# EAGLE design Esp8266-01_PACSSol (EAGLE 9.6.2)
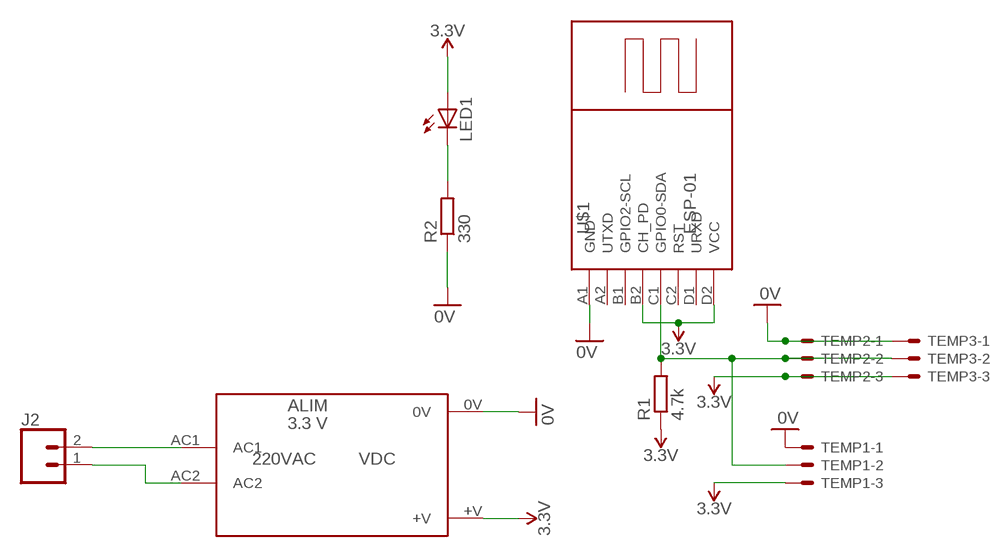
[diagram p0: schematic, sheet 1]

## Parts
ALIM  3.3 V  TSP05-5V-3W  [TSP05-VDC-3W]
J2  CONN_025MM  [BORNIER_A_VIS_2_5.12MM]
LED1  LED5MM_F  [LED5MM]
R1  4.7k  R-EU_0207/10  [0207/10]
R2  330  R-EU_0207/10  [0207/10]
TEMP1  JST-XH-03-PIN-LONG-PAD  [JST-XH-03-PACKAGE-LONG-PAD]
TEMP2  JST-XH-03-PIN-LONG-PAD  [JST-XH-03-PACKAGE-LONG-PAD]
TEMP3  JST-XH-03-PIN-LONG-PAD  [JST-XH-03-PACKAGE-LONG-PAD]
U$1  ESP-01  [ESP-01]

## Nets
0V: ALIM.0V R2.1 TEMP1.1 TEMP2.1 TEMP3.1 U$1.A1(GND)
3.3V: ALIM.+V LED1.A R1.1 TEMP1.3 TEMP2.3 TEMP3.3 U$1.B2(CH_PD) U$1.D2(VCC)
N$1: ALIM.AC1 J2.2
N$2: ALIM.AC2 J2.1
N$3: LED1.K(C) R2.2
N$4: R1.2 TEMP1.2 TEMP2.2 TEMP3.2 U$1.C1(GPIO0-SDA)
Unconnected: U$1.A2(UTXD) U$1.B1(GPIO2-SCL) U$1.C2(RST) U$1.D1(URXD)

## Library data of the parts
ALIM = _Remy:TSP05-5V-3W
J2 = _Remy:CONN_02: Multi connection point. Often used as Generic Header-pin footprint for 0.1 inch spaced/style header connections On any of the 0.1 inch spaced packages, you can populate with these: Break Away Headers - Straight <https://www.sparkfun.com/products/116> (PRT-00116) Break Away Male Headers - Right Angle <https://www.sparkfun.com/products/553> (PRT-00553) Female Headers <https://www.sparkfun.com/products/115> (PRT-00115) Break Away Headers - Machine Pin <https://www.sparkfun.com/products/117> (PRT-00117) Break Away Female Headers - Swiss Machine Pin <https://www.sparkfun.com/products/743> (PRT-00743) For SCREWTERMINALS and SPRING TERMINALS visit here: Screw Terimnals on SparkFun.com <https://www.sparkfun.com/search/results?term=Screw+Terminals> (5mm/3.5mm/2.54mm spacing) This device is also useful as a general connection point to wire up your design to another part of your project. Our various solder wires solder well into these plated through hole pads. Hook-Up Wire - Assortment (Stranded, 22 AWG) <https://www.sparkfun.com/products/11375> (PRT-11375) Hook-Up Wire - Assortment (Solid Core, 22 AWG) <https://www.sparkfun.com/products/11367> (PRT-11367) View the entire wire category on our website here <https://www.sparkfun.com/categories/141> Special notes: Molex polarized connector foot print use with: PRT-08233 with associated crimp pins and housings. 2.54_SCREWTERM for use with PRT-10571. 3.5mm Screw Terminal footprints for PRT-08084 5mm Screw Terminal footprints for use with PRT-08432; SF_SKU: PRT-08432
LED1 = 04_Remy:LED: LEDS
R1 R2 = 04_Remy:R-EU_: RESISTOR, European symbol
TEMP1-TEMP3 = con-JST XH Connectors v1-0:JST-XH-03-PIN: JST XH Connector 2 Pin Wire to board connector. Pitch: 2,54 mm, (0.100") Number of pins: 3 Created by Rembrandt Electronics www.rembrandtelectronics.com
U$1 = _Remy:ESP-01: Wireless Wi-Fi ESP-01 Module based on ESP8266 chip Click here to find device on ebay.com <http://www.ebay.com/sch/esp8266+esp+01+transceiver>

## Board
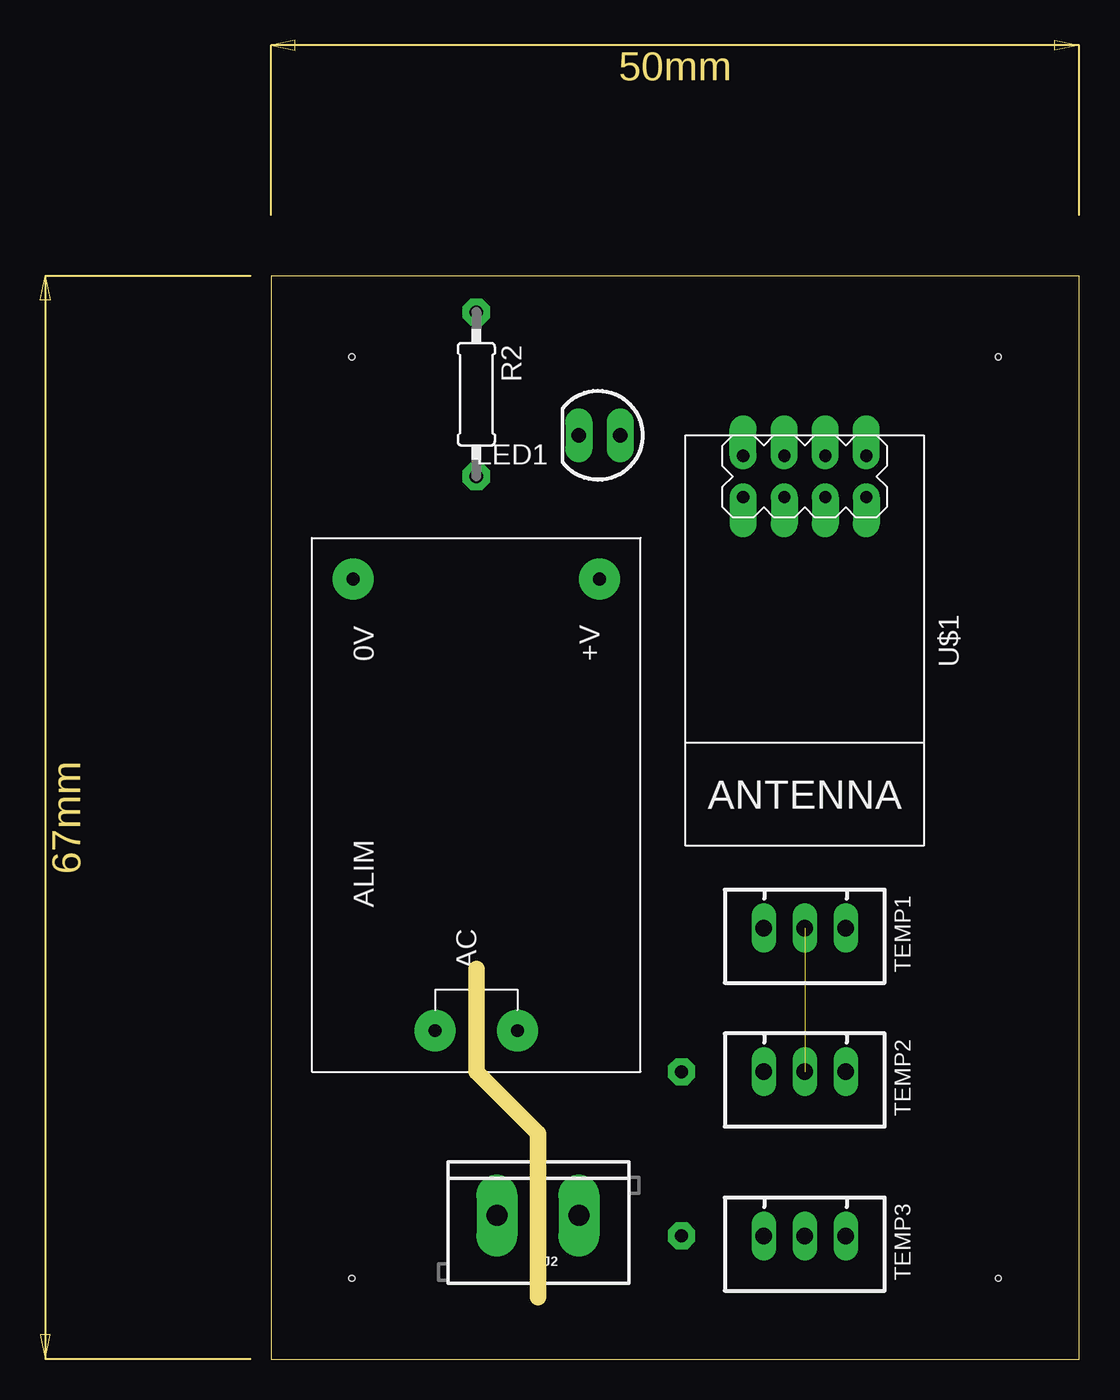
[diagram p1: board, top side]
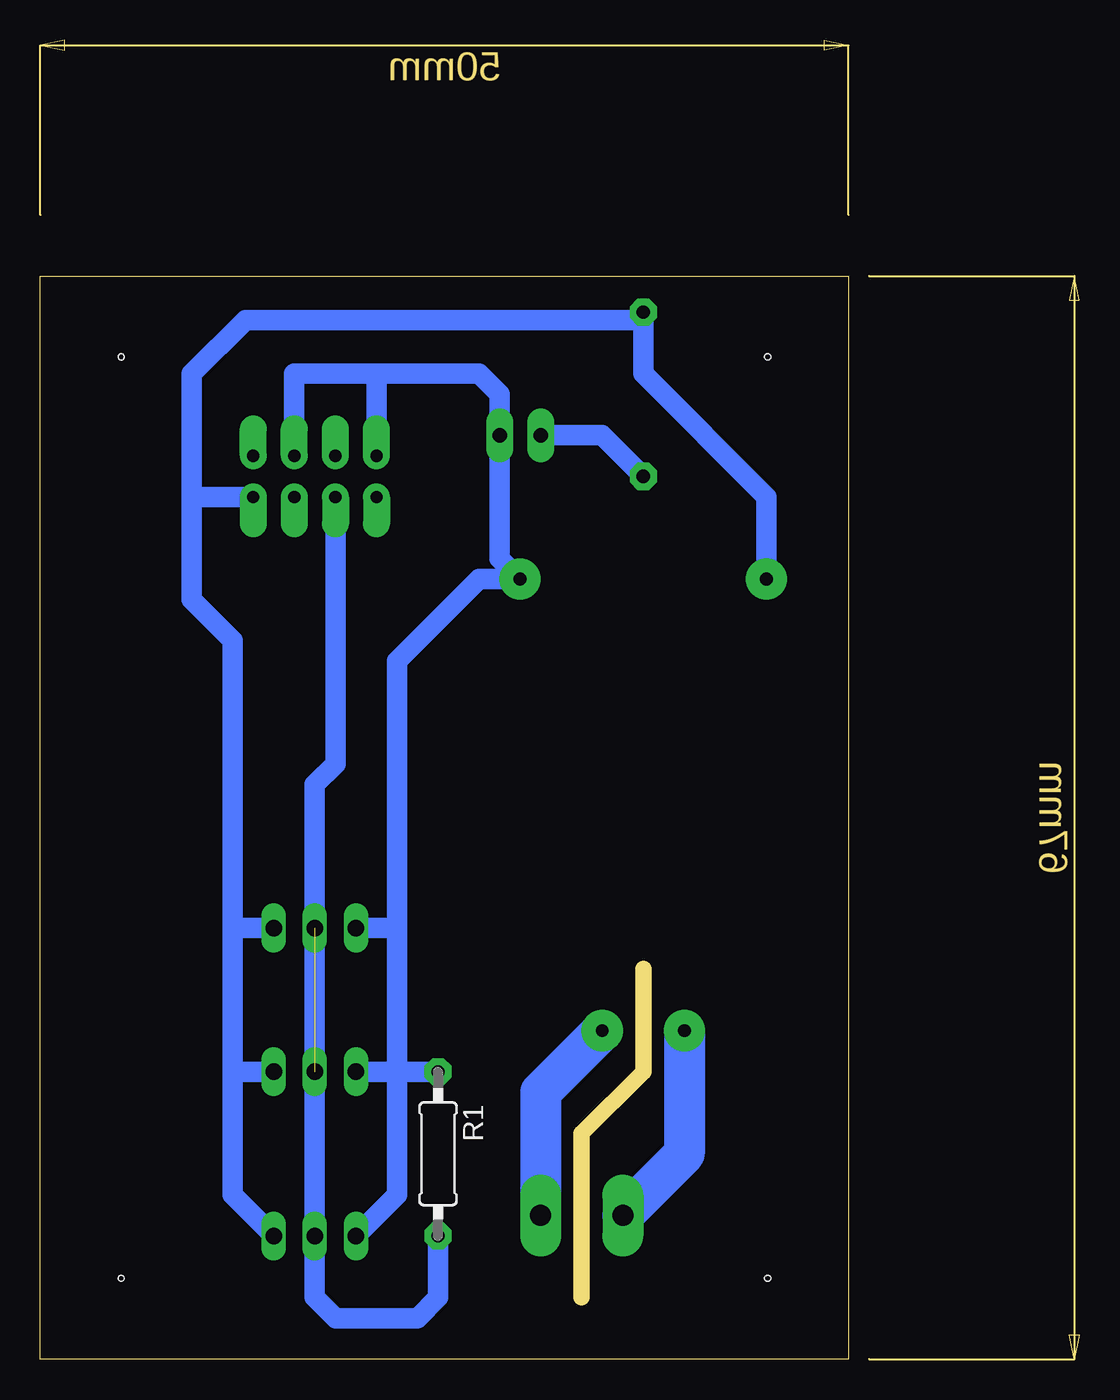
[diagram p2: board, bottom side, seen from below]

Size 50 x 67 mm. Coordinates in mm from the lower left corner, seen from the top.
Outline: 12.7,24.13 12.7,17.78 16.51,13.97 16.51,3.81
Outline: 0,0 50,0 50,67 0,67 0,0
Copper layers (1*16): Top 0.035mm / dielectric 0.15mm / Bottom 0.035mm
Design rules "FastGcode-DesignRules": minimum track width 6mil, minimum drill 0.35mm, track to track 6mil, track to pad 6mil, pad to pad 6mil, via to via 6mil, smd to smd 6mil, copper to edge 31mil, drill to drill 6mil, minimum pad ring 5mil, minimum via ring 8mil, stop-mask expansion 4mil, vias tented up to drill 0mil, thermal gap 165mil
Holes 0.35 mm at 5,62 45,62 45,5 5,5

### Footprints (pad centres in the part's own frame; a part is rotated, then mirrored left to right if it is on the bottom)
TSP05-VDC-3W = drill 0.8 pad 2.54: 0V 13.97,7.62; +V 13.97,-7.62; AC1 -13.97,2.54; AC2 -13.97,-2.54
BORNIER_A_VIS_2_5.12MM = drill 1.3 pad 2.54 long: 1 -2.54,0; 2 2.54,0
LED5MM = drill 0.9 pad 1.676 long: A -1.27,0; K 1.27,0
0207/10 = drill 0.813 pad 1.676 octagon: 1 -5.08,0; 2 5.08,0
JST-XH-03-PACKAGE-LONG-PAD = drill 1.016 long: 1 -2.54,0; 2 0,0; 3 2.54,0
ESP-01 = drill 0.75 pad 1.676 offset: A1 -8.89,3.81; A2 -11.43,3.81; B1 -8.89,1.27; B2 -11.43,1.27; C1 -8.89,-1.27; C2 -11.43,-1.27; D1 -8.89,-3.81; D2 -11.43,-3.81

### Placement (x,y rotation side)
ALIM  12.7,34.29 90 top
J2  16.51,8.89 180 top
LED1  20.32,57.15 180 top
R1  25.4,12.7 270 bottom
R2  12.7,59.69 270 top
TEMP1  33.02,26.67 180 top
TEMP2  33.02,17.78 180 top
TEMP3  33.02,7.62 180 top
U$1  33.02,44.45 270 top

### Tracks (layer width: path | path; a pad name or v marks a point on that pad's centre or on a via)
0V
  Bottom 1.27: ALIM.0V 5.08,53.34 12.7,60.96 R2.1 13.18,64.29 37.31,64.29 40.64,60.96 40.64,53.34 | 40.64,53.34 40.64,46.99 38.1,44.45 38.1,26.67 | U$1.A1 40.64,53.34 | TEMP3.1 38.1,10.16 38.1,17.78 | 38.1,17.78 38.1,26.67 | TEMP1.1 38.1,26.67 | TEMP2.1 38.1,17.78
3.3V
  Bottom 1.016: 30.48,18.03 TEMP2.3
  Bottom 1.27: U$1.B2 34.29,60.96 29.21,60.96 | 29.21,60.96 22.86,60.96 21.59,59.69 LED1.A 21.59,49.53 ALIM.+V 22.86,48.26 27.94,43.18 27.94,26.67 | 29.21,60.96 U$1.D2 | 27.94,17.78 R1.1 | TEMP3.3 27.94,10.16 27.94,17.78 | 27.94,17.78 27.94,26.67 | TEMP1.3 27.94,26.67 | TEMP2.3 27.94,17.78
N$1
  Bottom 2.54: ALIM.AC1 10.16,12.7 J2.2
N$2
  Bottom 2.54: ALIM.AC2 19.05,16.51 J2.1
N$3
  Bottom 1.27: R2.2 15.24,57.15 LED1.K
N$4  (1 unrouted)
  Bottom 1.27: U$1.C1 31.75,36.83 33.02,35.56 TEMP1.2 TEMP3.2 33.02,3.81 31.75,2.54 26.67,2.54 25.4,3.81 R1.2